# EAGLE design ESP32VGAv2 (EAGLE 6.6.0)
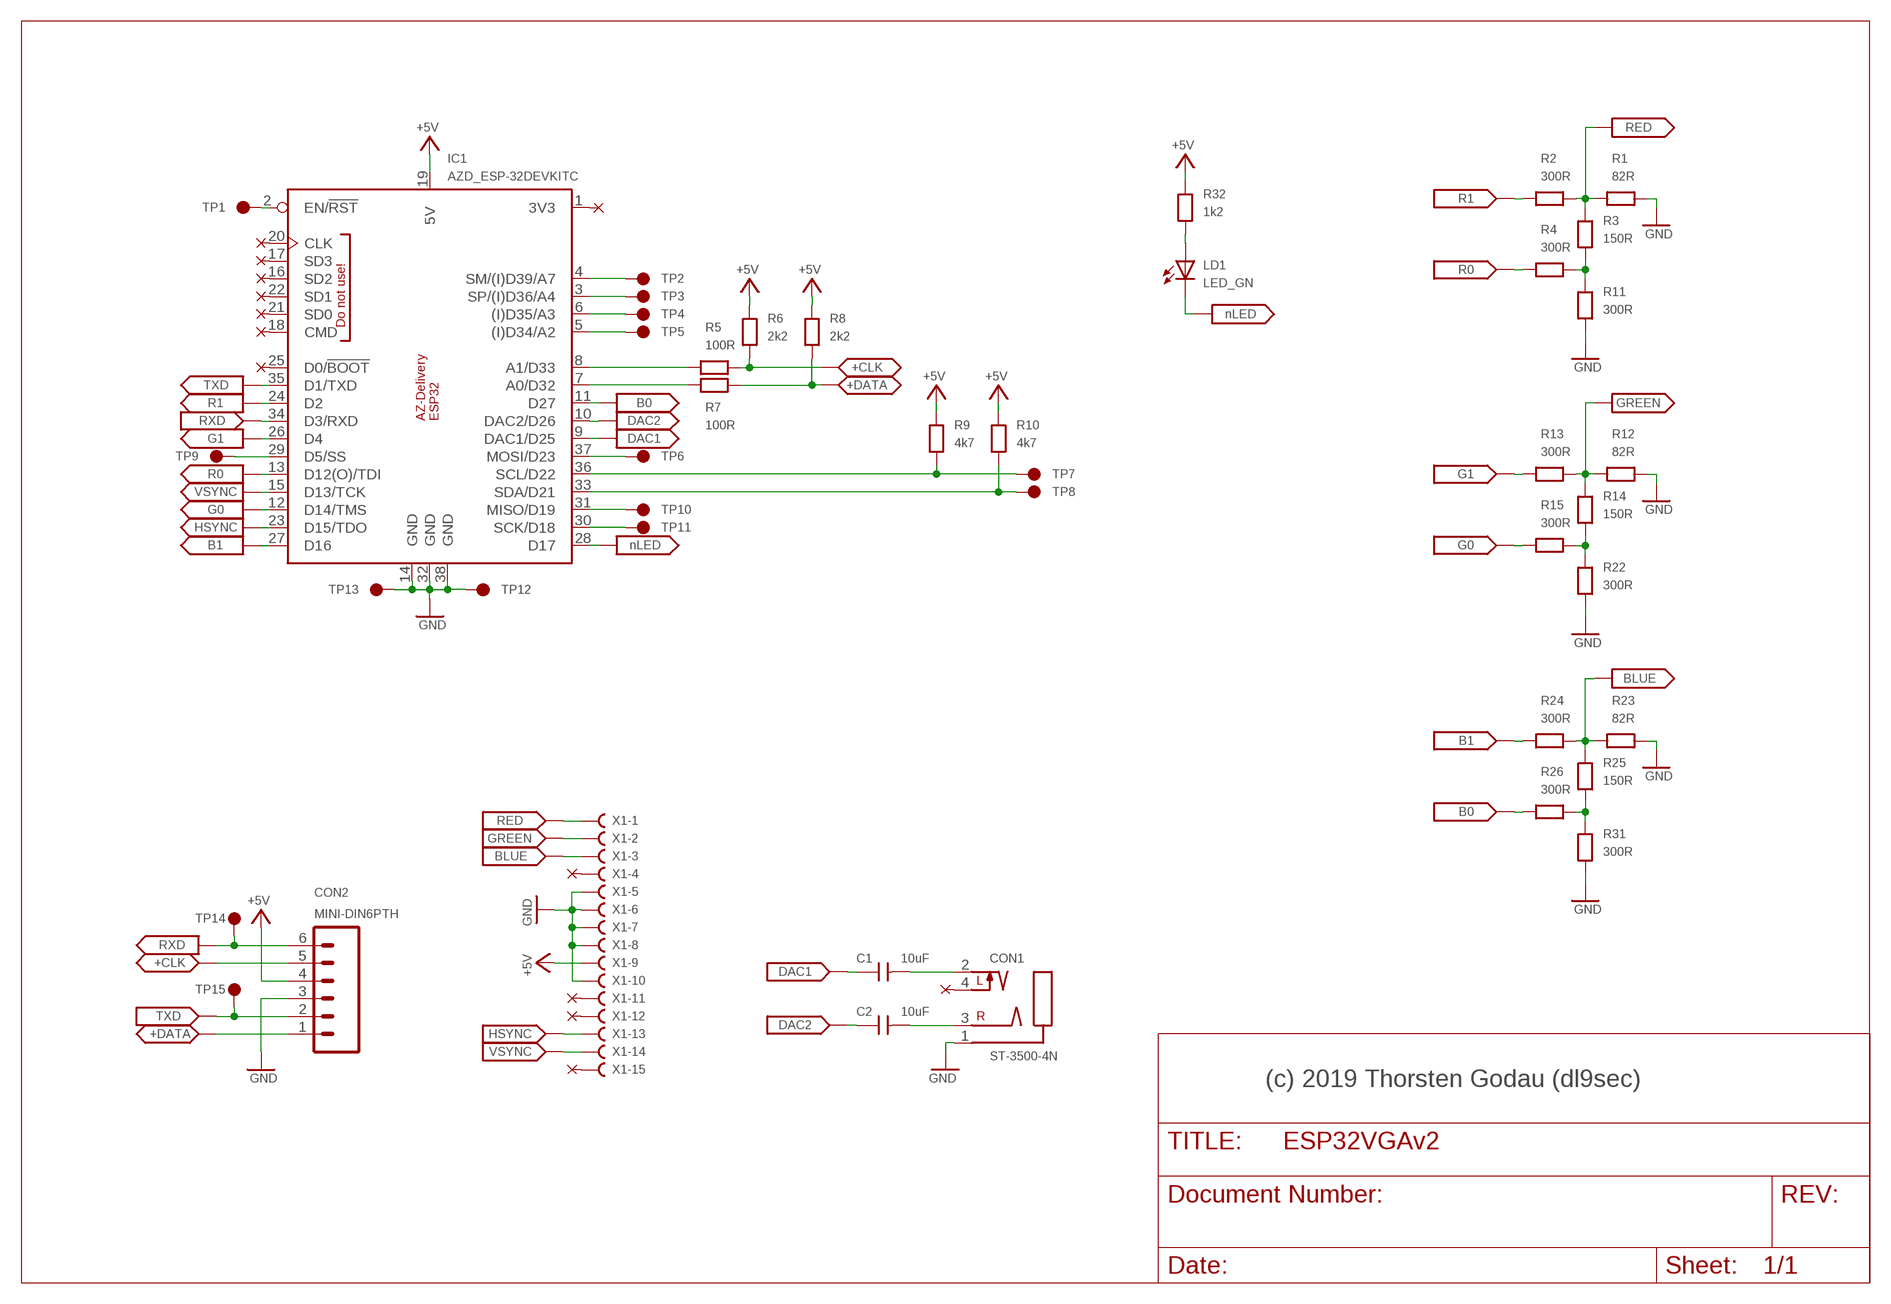
[diagram p0: schematic, sheet 1]

## Parts
C1  10uF  C0805  [0805]
C2  10uF  C0805  [0805]
CON1  ST-3500-4N  [ST-3500-4N]
CON2  MINI-DIN6PTH  [MINI-DIN6]
IC1  AZD_ESP-32DEVKITC  [AZD_ESP-32DEVKITC]
LD1  LED_GN  LED_3MM_GN_H  [LED3MMH]
R1  82R  R0805  [0805]
R2  300R  R0805  [0805]
R3  150R  R0805  [0805]
R4  300R  R0805  [0805]
R5  100R  R0805  [0805]
R6  2k2  R0805  [0805]
R7  100R  R0805  [0805]
R8  2k2  R0805  [0805]
R9  4k7  R0805  [0805]
R10  4k7  R0805  [0805]
R11  300R  R0805  [0805]
R12  82R  R0805  [0805]
R13  300R  R0805  [0805]
R14  150R  R0805  [0805]
R15  300R  R0805  [0805]
R22  300R  R0805  [0805]
R23  82R  R0805  [0805]
R24  300R  R0805  [0805]
R25  150R  R0805  [0805]
R26  300R  R0805  [0805]
R31  300R  R0805  [0805]
R32  1k2  R0805  [0805]
TP1  TESTPINTHT  [TESTPIN_THT]
TP2  TESTPINTHT  [TESTPIN_THT]
TP3  TESTPINTHT  [TESTPIN_THT]
TP4  TESTPINTHT  [TESTPIN_THT]
TP5  TESTPINTHT  [TESTPIN_THT]
TP6  TESTPINTHT  [TESTPIN_THT]
TP7  TESTPINTHT  [TESTPIN_THT]
TP8  TESTPINTHT  [TESTPIN_THT]
TP9  TESTPINTHT  [TESTPIN_THT]
TP10  TESTPINTHT  [TESTPIN_THT]
TP11  TESTPINTHT  [TESTPIN_THT]
TP12  TESTPINTHT  [TESTPIN_THT]
TP13  TESTPINTHT  [TESTPIN_THT]
TP14  TESTPINTHT  [TESTPIN_THT]
TP15  TESTPINTHT  [TESTPIN_THT]
X1  HF15HS  [HDF15H]

## Nets
+5V: CON2.4 IC1.19(5V) R6.2 R8.2 R9.2 R10.2 R32.2 X1.9
+CLK: CON2.5 R5.2 R6.1
+DATA: CON2.1 R7.2 R8.1
B0: IC1.11(D27) R26.1
B1: IC1.27(D16) R24.1
BLUE: R23.1 R24.2 R25.2 X1.3
DAC1: C1.1 IC1.9(DAC1/D25)
DAC2: C2.1 IC1.10(DAC2/D26)
G0: IC1.12(D14/TMS) R15.1
G1: IC1.26(D4) R13.1
GND: CON1.1(COM) CON2.3 IC1.14(GND) IC1.32(GND) IC1.38(GND) R1.2 R11.1 R12.2 R22.1 R23.2 R31.1 TP12.1(TP) TP13.1(TP) X1.5 X1.6 X1.7 X1.8 X1.10
GREEN: R12.1 R13.2 R14.2 X1.2
HSYNC: IC1.23(D15/TDO) X1.13
KBD_CLK: IC1.8(A1/D33) R5.1
KBD_DATA: IC1.7(A0/D32) R7.1
N$1: R14.1 R15.2 R22.2
N$3: IC1.4(SM/(I)D39/A7) TP2.1(TP)
N$4: IC1.3(SP/(I)D36/A4) TP3.1(TP)
N$5: R3.1 R4.2 R11.2
N$6: IC1.6((I)D35/A3) TP4.1(TP)
N$7: IC1.5((I)D34/A2) TP5.1(TP)
N$8: IC1.2(EN/!RST!) TP1.1(TP)
N$9: C1.2 CON1.2(L)
N$10: LD1.A R32.1
N$11: IC1.29(D5/SS) TP9.1(TP)
N$12: R25.1 R26.2 R31.2
N$13: IC1.30(SCK/D18) TP11.1(TP)
N$14: IC1.31(MISO/D19) TP10.1(TP)
N$15: C2.2 CON1.3(R)
N$65: IC1.33(SDA/D21) R10.1 TP8.1(TP)
N$66: IC1.36(SCL/D22) R9.1 TP7.1(TP)
N$67: IC1.37(MOSI/D23) TP6.1(TP)
NLED: IC1.28(D17) LD1.K
R0: IC1.13(D12(O)/TDI) R4.1
R1: IC1.24(D2) R2.1
RED: R1.1 R2.2 R3.2 X1.1
RXD: CON2.6 IC1.34(D3/RXD) TP14.1(TP)
TXD: CON2.2 IC1.35(D1/TXD) TP15.1(TP)
VSYNC: IC1.15(D13/TCK) X1.14
Unconnected: CON1.4(LSW) IC1.1(3V3) IC1.16(SD2) IC1.17(SD3) IC1.18(CMD) IC1.20(CLK) IC1.21(SD0) IC1.22(SD1) IC1.25(D0/!BOOT!) X1.4 X1.11 X1.12 X1.15

## Notes on the sheet
- (c) 2019 Thorsten Godau (dl9sec)

## Library data of the parts
C1 C2 = dl9sec_public:C: Capacity
CON1 = dl9sec_public:ST-3500-4N: KYCON stereo headphone jack 3,5mm SMD Typ ST-3500-4N, Stereo, with switch Rmax. = 100mR Umax. = 16V Imax. = 300mA
CON2 = SparkFunEagle-2-20-08:MINI-DIN6: mini DIN 6 Connector Commonly found on the back of a computer for PS2 keyboard and mice. Schematic and footprint are proven. Spark Fun Electronics SKU : PRT-08509
IC1 = dl9sec_public:AZD_ESP-32DEVKITC: AZ-Delivery ESP-32 DevKitC https://www.az-delivery.de/products/esp32-developmentboard?ls=de&cache=false https://cdn.shopify.com/s/files/1/1509/1638/files/ESP_-_32_NodeMCU_Developmentboard_Pinout_Diagram.jpg?4479111012146266271 https://bibliothek.az-delivery.de/wp-content/uploads/2018/01/4-AZ-Delivery_ESP32-Development-Board_Startertutorial.pdf
LD1 = dl9sec_public:LED_3MM_GN: LED (green) Kingbright L-934SGC
R1-R15 R22-R26 R31 R32 = dl9sec_public:R: Resistor
TP1-TP15 = dl9sec_public:TESTPIN: Testpin/Testpad
X1 = con-subd:HF15?S: SUB-D; OC_FARNELL: unknown; OC_NEWARK: unknown

## Board
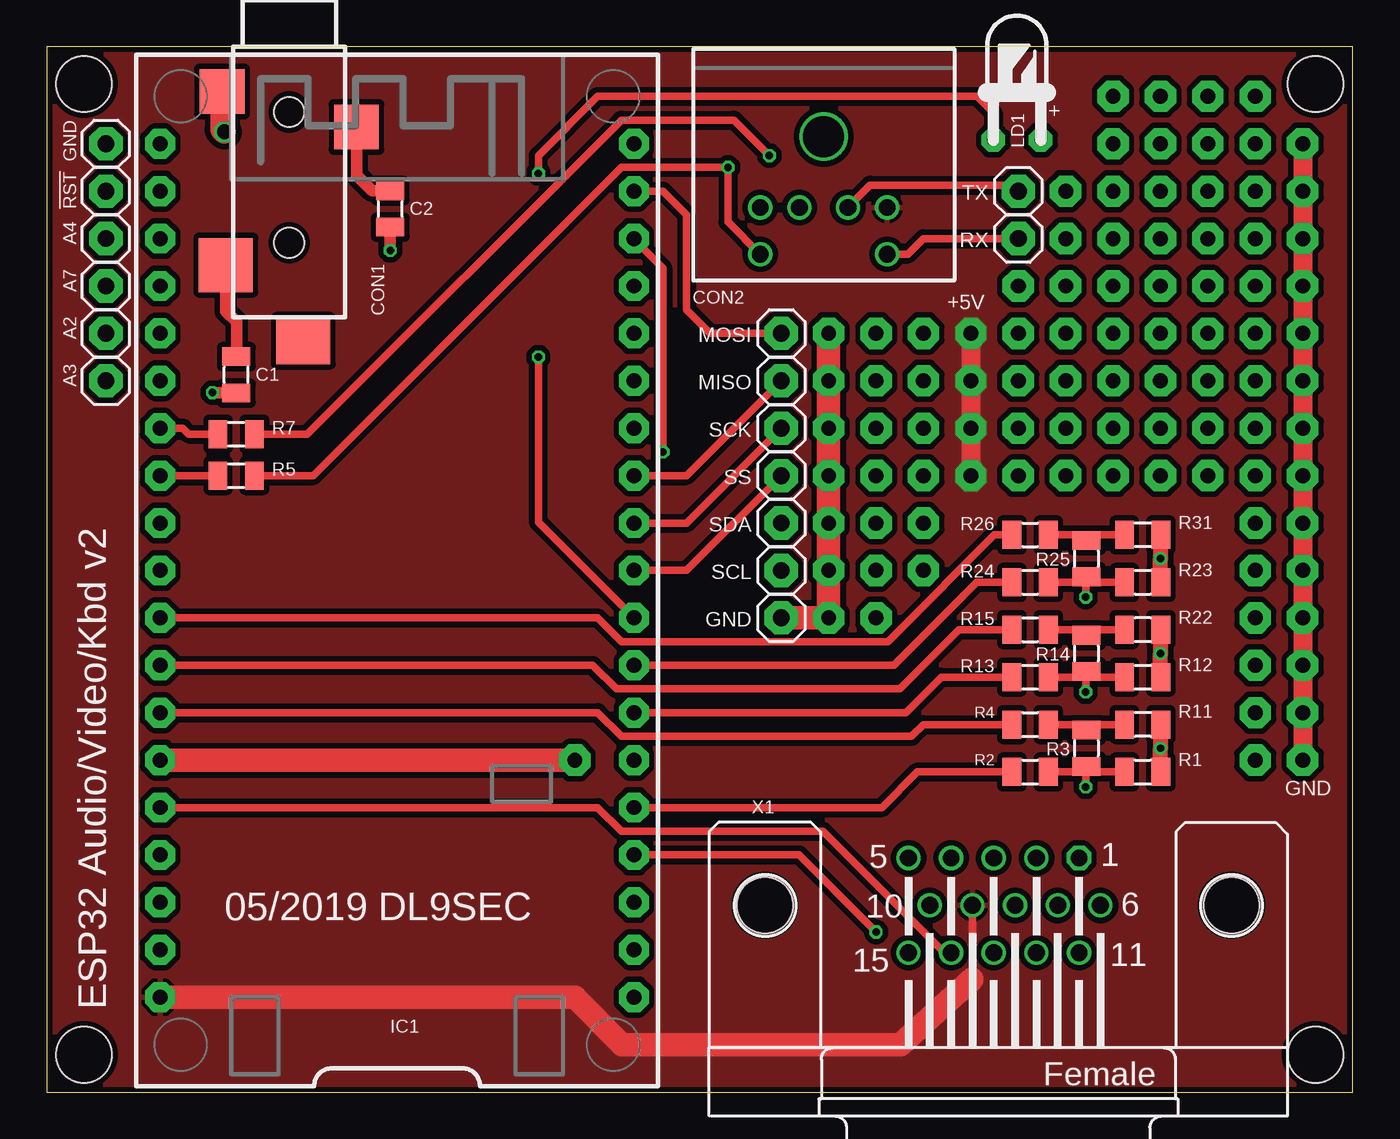
[diagram p1: board, top side]
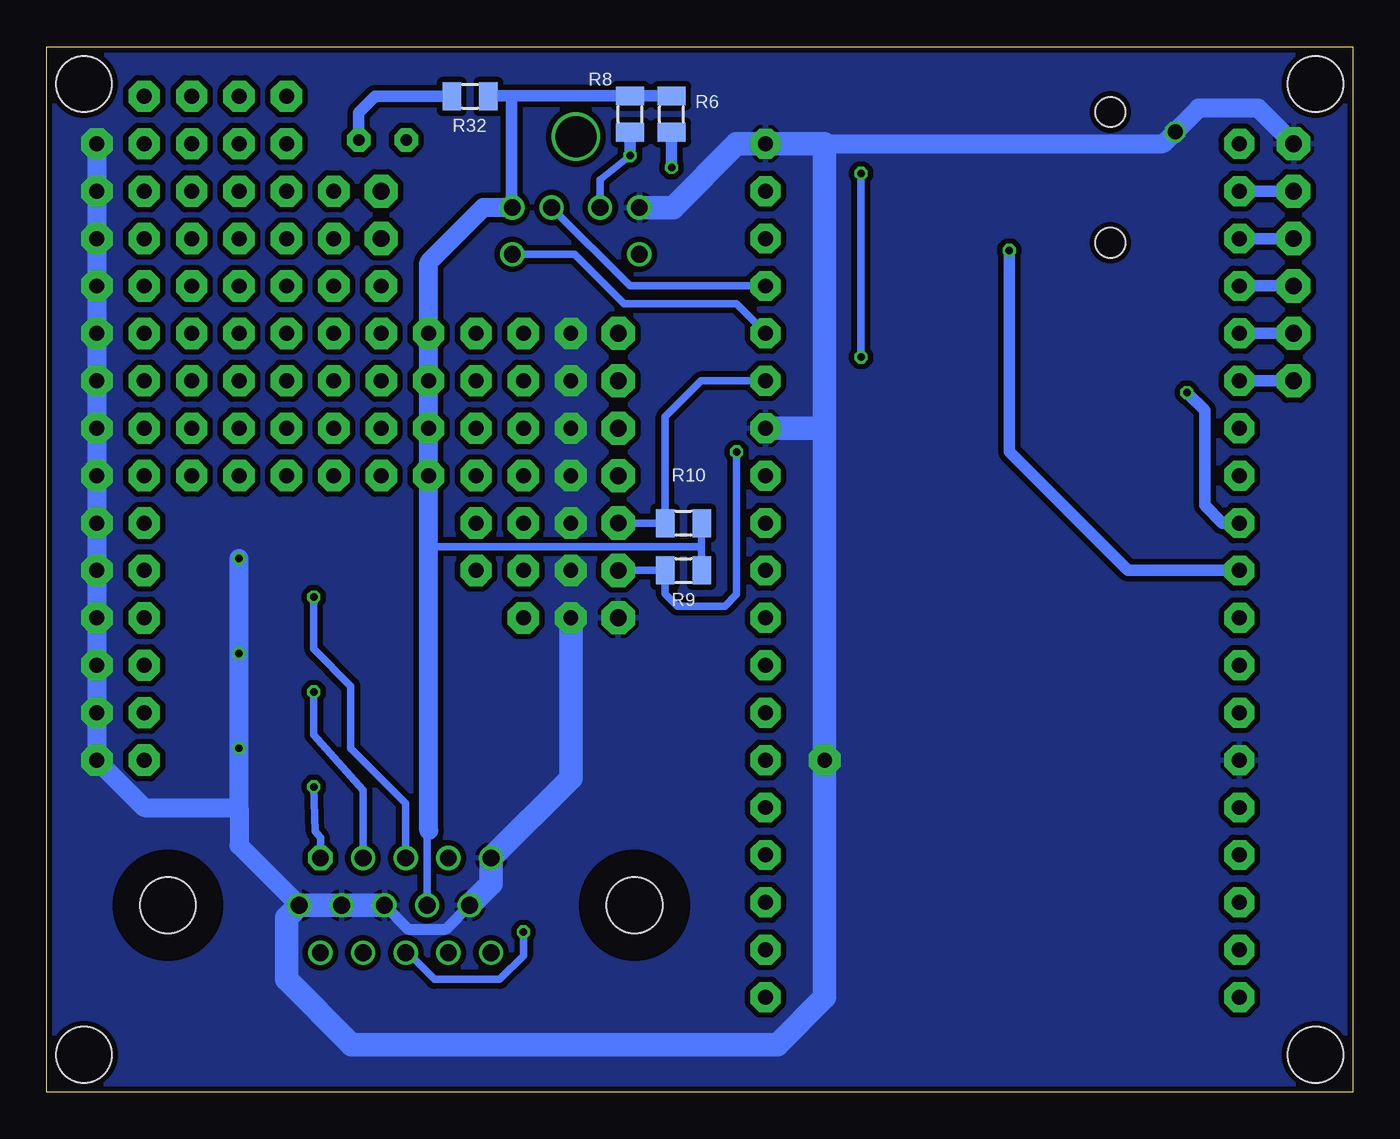
[diagram p2: board, bottom side, seen from below]

Size 70 x 56 mm. Coordinates in mm from the lower left corner, seen from the top.
Outline: 0,0 70,0 70,56 0,56 0,0
Copper layers (1*16): Top 0.035mm / dielectric 1.5mm / Bottom 0.035mm
Design rules "PCB-POOL Standard": minimum track width 0.15mm, minimum drill 0.3mm, track to track 0.15mm, track to pad 0.15mm, pad to pad 0.15mm, via to via 0.15mm, smd to smd 0.15mm, copper to edge 0.3mm, drill to drill 0.2mm, minimum pad ring 0.2mm, minimum via ring 0.15mm, stop-mask expansion 0.075mm, vias tented up to drill 0mil, thermal gap 0.2mm
Holes 3 mm at 2,2 2,54 68,54 68,2

### Footprints (pad centres in the part's own frame; a part is rotated, then mirrored left to right if it is on the bottom)
0805 = smd 1 x 1.5: 1 -0.976,0; 2 0.976,0
ST-3500-4N = smd 2.4 x 2.4: 1 -3.6,-2.4; 3 3.6,-4.3 | smd 2.9 x 2.9: 2 -3.4,-11.7 | smd 2.9 x 2.5: 4 0.75,-15.75 | hole 1.6: 0,-3.5; 0,-10.5
MINI-DIN6 = drill 0.9: 1 -1.3,-8.5; 2 1.3,-8.5; 3 -3.4,-8.5; 4 3.4,-8.5; 5 -3.4,-11; 6 3.4,-11 | drill 2.2: P$1 0,-4.7
AZD_ESP-32DEVKITC = drill 0.8 pad 1.6 octagon: 1 -12.7,22.86; 2 -12.7,20.32; 3 -12.7,17.78; 4 -12.7,15.24; 5 -12.7,12.7; 6 -12.7,10.16; 7 -12.7,7.62; 8 -12.7,5.08; 9 -12.7,2.54; 10 -12.7,0; 11 -12.7,-2.54; 12 -12.7,-5.08; 13 -12.7,-7.62; 14 -12.7,-10.16; 15 -12.7,-12.7; 16 -12.7,-15.24; 17 -12.7,-17.78; 18 -12.7,-20.32; 19 -12.7,-22.86; 20 12.7,-22.86; 21 12.7,-20.32; 22 12.7,-17.78; 23 12.7,-15.24; 24 12.7,-12.7; 25 12.7,-10.16; 26 12.7,-7.62; 27 12.7,-5.08; 28 12.7,-2.54; 29 12.7,0; 30 12.7,2.54; 31 12.7,5.08; 32 12.7,7.62; 33 12.7,10.16; 34 12.7,12.7; 35 12.7,15.24; 36 12.7,17.78; 37 12.7,20.32; 38 12.7,22.86
LED3MMH = drill 0.61 pad 1.27 octagon: A -1.27,0; K 1.27,0
TESTPIN_THT = drill 0.9 pad 1.778 octagon: 1 0,0
HDF15H = drill 0.9 octagon: 1 4.329,2.54 | drill 0.9: 2 2.043,2.54; 3 -0.243,2.54; 4 -2.529,2.54; 5 -4.815,2.54; 6 5.472,0; 7 3.186,0; 8 0.9,0; 9 -1.386,0; 10 -3.672,0; 11 4.329,-2.54; 12 2.043,-2.54; 13 -0.243,-2.54; 14 -2.529,-2.54; 15 -4.815,-2.54 | hole 3: -12.5,0; 12.5,0

### Placement (x,y rotation side)
C1  10.16,38.42 90 top
C2  18.41,47.31 90 top
CON1  13,56 0 top
CON2  41.64,55.88 0 top
IC1  18.78,27.94 0 top
LD1  52,51 180 top
R1  58.74,17.14 0 top
R2  52.7,17.14 0 top
R3  55.72,18.41 270 top
R4  52.7,19.68 0 top
R5  10.16,33.02 0 top
R6  36.51,52.39 90 bottom
R7  10.16,35.24 0 top
R8  38.73,52.39 90 bottom
R9  35.88,27.94 0 bottom
R10  35.88,30.48 0 bottom
R11  58.74,19.68 180 top
R12  58.74,22.23 0 top
R13  52.7,22.23 0 top
R14  55.72,23.5 270 top
R15  52.7,24.77 0 top
R22  58.74,24.77 180 top
R23  58.74,27.3 0 top
R24  52.7,27.3 0 top
R25  55.72,28.57 270 top
R26  52.7,29.84 0 top
R31  58.74,29.84 180 top
R32  47.31,53.34 0 bottom
TP1  3.17,48.26 180 top
TP2  3.17,43.18 180 top
TP3  3.17,45.72 180 top
TP4  3.17,38.1 180 top
TP5  3.17,40.64 180 top
TP6  39.37,40.64 0 top
TP7  39.37,27.94 0 top
TP8  39.37,30.48 0 top
TP9  39.37,33.02 0 top
TP10  39.37,38.1 0 top
TP11  39.37,35.56 0 top
TP12  3.17,50.8 180 top
TP13  39.37,25.4 0 top
TP14  52.07,45.72 0 top
TP15  52.07,48.26 0 top
X1  51,10 0 top

### Tracks (layer width: path | path; a pad name or v marks a point on that pad's centre or on a via)
+5V  (via drill 0.8 pad 1.68)
  Top 0.406: X1.9 49.61,6.07 49.58,6.03
  Top 1.016: v49.53,40.64 v49.53,38.1 v49.53,35.56 v49.53,33.02
  Top 1.27: 49.58,6.03 45.77,2.54 30.84,2.54 28.3,5.08 IC1.19
  Bottom 0.406: CON2.4 45.09,47.42 | R10.2 34.9,29.23 34.92,29.21 | R9.2 34.9,29.19 34.92,29.21 | X1.9 49.61,13.89 49.53,13.97 49.53,14.02 | 34.92,29.21 49.53,29.21
  Bottom 0.61: R6.2 R8.2 45.09,53.36 | 45.09,47.42 45.09,53.36 | R32.2 46.33,53.36 45.09,53.36
  Bottom 1.016: 49.53,14.02 49.53,29.21 v49.53,33.02 v49.53,35.56 v49.53,38.1 v49.53,40.64 49.53,44.45 46.6,47.38 CON2.4
  pour Top (isolate 0.3): 0,0 0,56 70,56 70,0
+CLK  (via drill 0.4)
  Top 0.406: R5.2 14.29,33.02 30.8,49.53 v36.51,49.53 36.51,46.61 CON2.5
  Bottom 0.61: v36.51,49.53 R6.1
+DATA  (via drill 0.4)
  Top 0.406: R7.2 13.97,35.24 30.8,52.07 36.83,52.07 v38.73,50.16
  Bottom 0.406: v38.73,50.16 40.34,48.88 CON2.1
  Bottom 0.61: R8.1 v38.73,50.16
B0
  Top 0.406: IC1.11 29.53,25.4 30.8,24.13 38.42,24.13 40.32,24.13 45.09,24.13 45.4,24.45 50.8,29.84 R26.1
B1
  Top 0.406: IC1.27 45.4,22.86 49.85,27.3 R24.1
BLUE  (via drill 0.4)
  Top 0.406: R24.2 55.69,27.3 | 55.69,27.3 v55.69,26.51 | 55.69,27.3 55.72,27.3 | 55.72,27.3 R23.1 | R25.2 55.72,27.3
  Bottom 0.406: v55.69,26.51 55.69,23.73 53.7,21.75 53.7,18.41 50.76,15.47 X1.3
DAC1  (via drill 0.4)
  Top 0.406: 10.14,37.47 C1.1
  Top 0.61: v8.89,37.47 10.14,37.47
  Bottom 0.61: IC1.9 6.99,30.48 7.94,31.43 7.94,36.51 v8.89,37.47
DAC2  (via drill 0.4)
  Top 0.61: v18.41,45.09 C2.1
  Bottom 0.61: IC1.10 12.06,27.94 18.41,34.29 v18.41,45.09
G0
  Top 0.406: IC1.12 29.26,22.86 30.53,21.59 45.72,21.59 48.9,24.77 R15.1
G1
  Top 0.406: IC1.26 46.04,20.32 47.94,22.23 R13.1
GND  (via drill 0.4, 0.8, 0.8 pad 1.68)
  Top 0.813: R23.2 59.69,27.33 v59.69,28.57 59.69,29.82 R31.1 | R22.1 59.69,24.74 v59.69,23.5 59.69,22.25 R12.2 | R11.1 59.69,19.66 v59.69,18.41 59.69,17.17 R1.2
  Top 1.016: v67.31,50.8 v67.31,48.26 v67.31,45.72 v67.31,43.18 v67.31,40.64 v67.31,38.1 v67.31,35.56 v67.31,33.02 v67.31,30.48 v67.31,27.94 v67.31,25.4 v67.31,22.86 v67.31,20.32 v67.31,17.78
  Top 1.27: IC1.14 v28.3,17.78 | CON1.1 9.4,51.56 v9.53,51.44 | v41.91,40.64 v41.91,38.1 v41.91,35.56 v41.91,33.02 v41.91,30.48 v41.91,27.94 v41.91,25.4 TP13.1
  Bottom 0.6: X1.8 50.63,8.73 48.6,8.73 X1.10
  Bottom 0.813: X1.6 56.47,10.12
  Bottom 1.016: 59.69,15.24 v59.69,18.41 v59.69,23.5 v59.69,28.57 | v67.31,50.8 v67.31,48.26 v67.31,45.72 v67.31,43.18 v67.31,40.64 v67.31,38.1 v67.31,35.56 v67.31,33.02 v67.31,30.48 v67.31,27.94 v67.31,25.4 v67.31,22.86 v67.31,20.32 v67.31,17.78 64.77,15.24 59.69,15.24 | TP12.1 5.08,52.7 8.26,52.7 v9.53,51.44 10.16,50.8 28.3,50.8 | 59.69,15.24 59.69,13.22 X1.6
  Bottom 1.27: 28.3,35.56 28.3,50.8 IC1.38 33.02,50.8 36.44,47.38 CON2.3 | 28.3,35.56 v28.3,17.78 28.3,5.08 30.84,2.54 53.66,2.54 57.15,6.03 57.15,9.32 X1.6 X1.7 X1.8 | IC1.32 28.3,35.56 | X1.10 46.19,11.14 X1.5 41.91,16.82 v41.91,25.4
  pour Bottom (isolate 0.3): 0,56 70,56 70,0 0,0
GREEN  (via drill 0.4)
  Top 0.406: R13.2 55.69,22.23 | 55.69,22.23 v55.69,21.43 | 55.69,22.23 55.72,22.23 | 55.72,22.23 R12.1 | R14.2 55.72,22.23
  Bottom 0.406: v55.69,21.43 55.69,19.13 53.04,16.17 X1.2
HSYNC  (via drill 0.4)
  Top 0.406: v44.45,8.57 40.32,12.7 IC1.23
  Bottom 0.406: X1.13 50.64,7.46 49.21,6.03 45.72,6.03 44.45,7.3 v44.45,8.57
KBD_CLK
  Top 0.406: IC1.8 R5.1
KBD_DATA
  Top 0.406: IC1.7 7.3,35.56 7.62,35.24 R7.1
N$1
  Top 0.406: R15.2 55.72,24.77 | 55.72,24.77 R22.2 | R14.1 55.72,24.77
N$2  (via drill 0.8 pad 1.68)
  other vias: 64.77,50.8
N$3
  Bottom 0.61: IC1.4 TP2.1
N$4
  Bottom 0.61: IC1.3 TP3.1
N$5
  Top 0.406: R4.2 55.72,19.68 | 55.72,19.68 R11.2 | R3.1 55.72,19.68
N$6
  Bottom 0.61: IC1.6 TP4.1
N$7
  Bottom 0.61: IC1.5 TP5.1
N$8
  Bottom 0.61: IC1.2 TP1.1
N$9
  Top 0.61: CON1.2 9.6,41.84 10.18,41.26 10.18,39.41 C1.2
N$10
  Bottom 0.61: LD1.A 53.27,52.46 52.39,53.34 R32.1
N$11
  Top 0.406: IC1.29 34.29,27.94 TP9.1
N$12
  Top 0.406: R26.2 55.72,29.84 | 55.72,29.84 R31.2 | R25.1 55.72,29.84
N$13
  Top 0.406: IC1.30 34.29,30.48 TP11.1
N$14
  Top 0.406: IC1.31 34.29,33.02 TP10.1
N$15
  Top 0.61: 18.43,48.26 C2.2 17.44,48.28 16.6,49.12 CON1.3
N$16  (via drill 0.8 pad 1.68)
  other vias: 64.77,38.1
N$17  (via drill 0.8 pad 1.68)
  other vias: 64.77,40.64
N$18  (via drill 0.8 pad 1.68)
  other vias: 64.77,43.18
N$19  (via drill 0.8 pad 1.68)
  other vias: 64.77,45.72
N$20  (via drill 0.8 pad 1.68)
  other vias: 64.77,48.26
N$21  (via drill 0.8 pad 1.68)
  other vias: 64.77,35.56
N$22  (via drill 0.8 pad 1.68)
  other vias: 64.77,33.02
N$23  (via drill 0.8 pad 1.68)
  other vias: 62.23,33.02
N$24  (via drill 0.8 pad 1.68)
  other vias: 59.69,33.02
N$25  (via drill 0.8 pad 1.68)
  other vias: 62.23,35.56
N$26  (via drill 0.8 pad 1.68)
  other vias: 62.23,38.1
N$27  (via drill 0.8 pad 1.68)
  other vias: 62.23,40.64
N$28  (via drill 0.8 pad 1.68)
  other vias: 62.23,43.18
N$29  (via drill 0.8 pad 1.68)
  other vias: 62.23,45.72
N$30  (via drill 0.8 pad 1.68)
  other vias: 62.23,48.26
N$31  (via drill 0.8 pad 1.68)
  other vias: 62.23,50.8
N$32  (via drill 0.8 pad 1.68)
  other vias: 64.77,53.34
N$33  (via drill 0.8 pad 1.68)
  other vias: 62.23,53.34
N$34  (via drill 0.8 pad 1.68)
  other vias: 59.69,53.34
N$35  (via drill 0.8 pad 1.68)
  other vias: 57.15,53.34
N$36  (via drill 0.8 pad 1.68)
  other vias: 57.15,50.8
N$37  (via drill 0.8 pad 1.68)
  other vias: 59.69,50.8
N$38  (via drill 0.8 pad 1.68)
  other vias: 57.15,48.26
N$39  (via drill 0.8 pad 1.68)
  other vias: 59.69,48.26
N$40  (via drill 0.8 pad 1.68)
  other vias: 59.69,45.72
N$41  (via drill 0.8 pad 1.68)
  other vias: 59.69,43.18
N$42  (via drill 0.8 pad 1.68)
  other vias: 59.69,40.64
N$43  (via drill 0.8 pad 1.68)
  other vias: 59.69,38.1
N$44  (via drill 0.8 pad 1.68)
  other vias: 59.69,35.56
N$45  (via drill 0.8 pad 1.68)
  other vias: 57.15,33.02
N$46  (via drill 0.8 pad 1.68)
  other vias: 57.15,35.56
N$47  (via drill 0.8 pad 1.68)
  other vias: 57.15,38.1
N$48  (via drill 0.8 pad 1.68)
  other vias: 57.15,40.64
N$49  (via drill 0.8 pad 1.68)
  other vias: 57.15,43.18
N$50  (via drill 0.8 pad 1.68)
  other vias: 57.15,45.72
N$51  (via drill 0.8 pad 1.68)
  other vias: 54.61,48.26
N$52  (via drill 0.8 pad 1.68)
  other vias: 64.77,30.48
N$53  (via drill 0.8 pad 1.68)
  other vias: 64.77,27.94
N$54  (via drill 0.8 pad 1.68)
  other vias: 52.07,43.18
N$55  (via drill 0.8 pad 1.68)
  other vias: 52.07,40.64
N$56  (via drill 0.8 pad 1.68)
  other vias: 52.07,38.1
N$57  (via drill 0.8 pad 1.68)
  other vias: 52.07,35.56
N$58  (via drill 0.8 pad 1.68)
  other vias: 64.77,25.4
N$59  (via drill 0.8 pad 1.68)
  other vias: 54.61,33.02
N$60  (via drill 0.8 pad 1.68)
  other vias: 54.61,35.56
N$61  (via drill 0.8 pad 1.68)
  other vias: 54.61,38.1
N$62  (via drill 0.8 pad 1.68)
  other vias: 54.61,40.64
N$63  (via drill 0.8 pad 1.68)
  other vias: 54.61,43.18
N$64  (via drill 0.8 pad 1.68)
  other vias: 54.61,45.72
N$65
  Bottom 0.406: TP8.1 R10.1 36.85,36.17 34.92,38.1 IC1.33
N$66  (via drill 0.4)
  Top 0.406: IC1.36 31.48,45.67 33.02,44.13 v33.02,34.29
  Bottom 0.406: TP7.1 R9.1 36.85,26.69 36.2,26.04 33.66,26.04 33.02,26.67 v33.02,34.29
N$67
  Top 0.406: IC1.37 33.02,48.26 34.29,46.99 34.29,41.91 35.56,40.64 TP6.1
N$68  (via drill 0.8 pad 1.68)
  other vias: 52.07,33.02
N$69  (via drill 0.8 pad 1.68)
  other vias: 46.99,40.64
N$70  (via drill 0.8 pad 1.68)
  other vias: 46.99,38.1
N$71  (via drill 0.8 pad 1.68)
  other vias: 46.99,35.56
N$72  (via drill 0.8 pad 1.68)
  other vias: 64.77,22.86
N$73  (via drill 0.8 pad 1.68)
  other vias: 64.77,20.32
N$74  (via drill 0.8 pad 1.68)
  other vias: 64.77,17.78
N$75  (via drill 0.8 pad 1.68)
  other vias: 44.45,25.4
N$77  (via drill 0.8 pad 1.68)
  other vias: 46.99,33.02
N$78  (via drill 0.8 pad 1.68)
  other vias: 46.99,30.48
N$79  (via drill 0.8 pad 1.68)
  other vias: 44.45,30.48
N$80  (via drill 0.8 pad 1.68)
  other vias: 44.45,33.02
N$81  (via drill 0.8 pad 1.68)
  other vias: 44.45,35.56
N$82  (via drill 0.8 pad 1.68)
  other vias: 44.45,38.1
N$83  (via drill 0.8 pad 1.68)
  other vias: 44.45,40.64
N$92  (via drill 0.8 pad 1.68)
  other vias: 44.45,27.94
N$93  (via drill 0.8 pad 1.68)
  other vias: 46.99,27.94
NLED  (via drill 0.4)
  Top 0.406: IC1.28 26.35,30.53 v26.35,39.37 | v26.35,49.21 26.35,50.16 29.53,53.34 49.85,53.34 50.73,52.46 LD1.K
  Bottom 0.406: v26.35,39.37 v26.35,49.21
R0
  Top 0.406: IC1.13 29.53,20.32 30.8,19.05 46.35,19.05 46.99,19.68 R4.1
R1
  Top 0.406: IC1.24 44.77,15.24 46.67,17.14 R2.1
RED  (via drill 0.4)
  Top 0.406: R2.2 55.69,17.14 | 55.69,17.14 v55.69,16.35 | 55.69,17.14 55.72,17.14 | 55.72,17.14 R1.1 | R3.2 55.72,17.14
  Bottom 0.406: v55.69,16.35 55.61,13.97 55.33,13.62 X1.1
RXD
  Top 0.406: CON2.6 46.15,44.88 46.99,45.72 TP14.1
  Bottom 0.406: IC1.34 31.48,40.69 33.02,42.23 39.05,42.23 41.7,44.88 CON2.6
TXD
  Top 0.406: CON2.2 44.13,48.58 51.75,48.58 TP15.1
  Bottom 0.406: CON2.2 38.74,43.18 IC1.35
VSYNC
  Top 0.406: IC1.15 29.53,15.24 30.8,13.97 41.59,13.97 48.1,7.46 X1.14

### Text on the board
tPlace: GND | TX | !RST! | RX | A4 | A7 | +5V | MOSI | A2 | A3 | MISO | SCK | SS | SDA | SCL | GND | GND | 05/2019 DL9SEC | ESP32 Audio/Video/Kbd v2